# EasyEDA schematic pcb.json
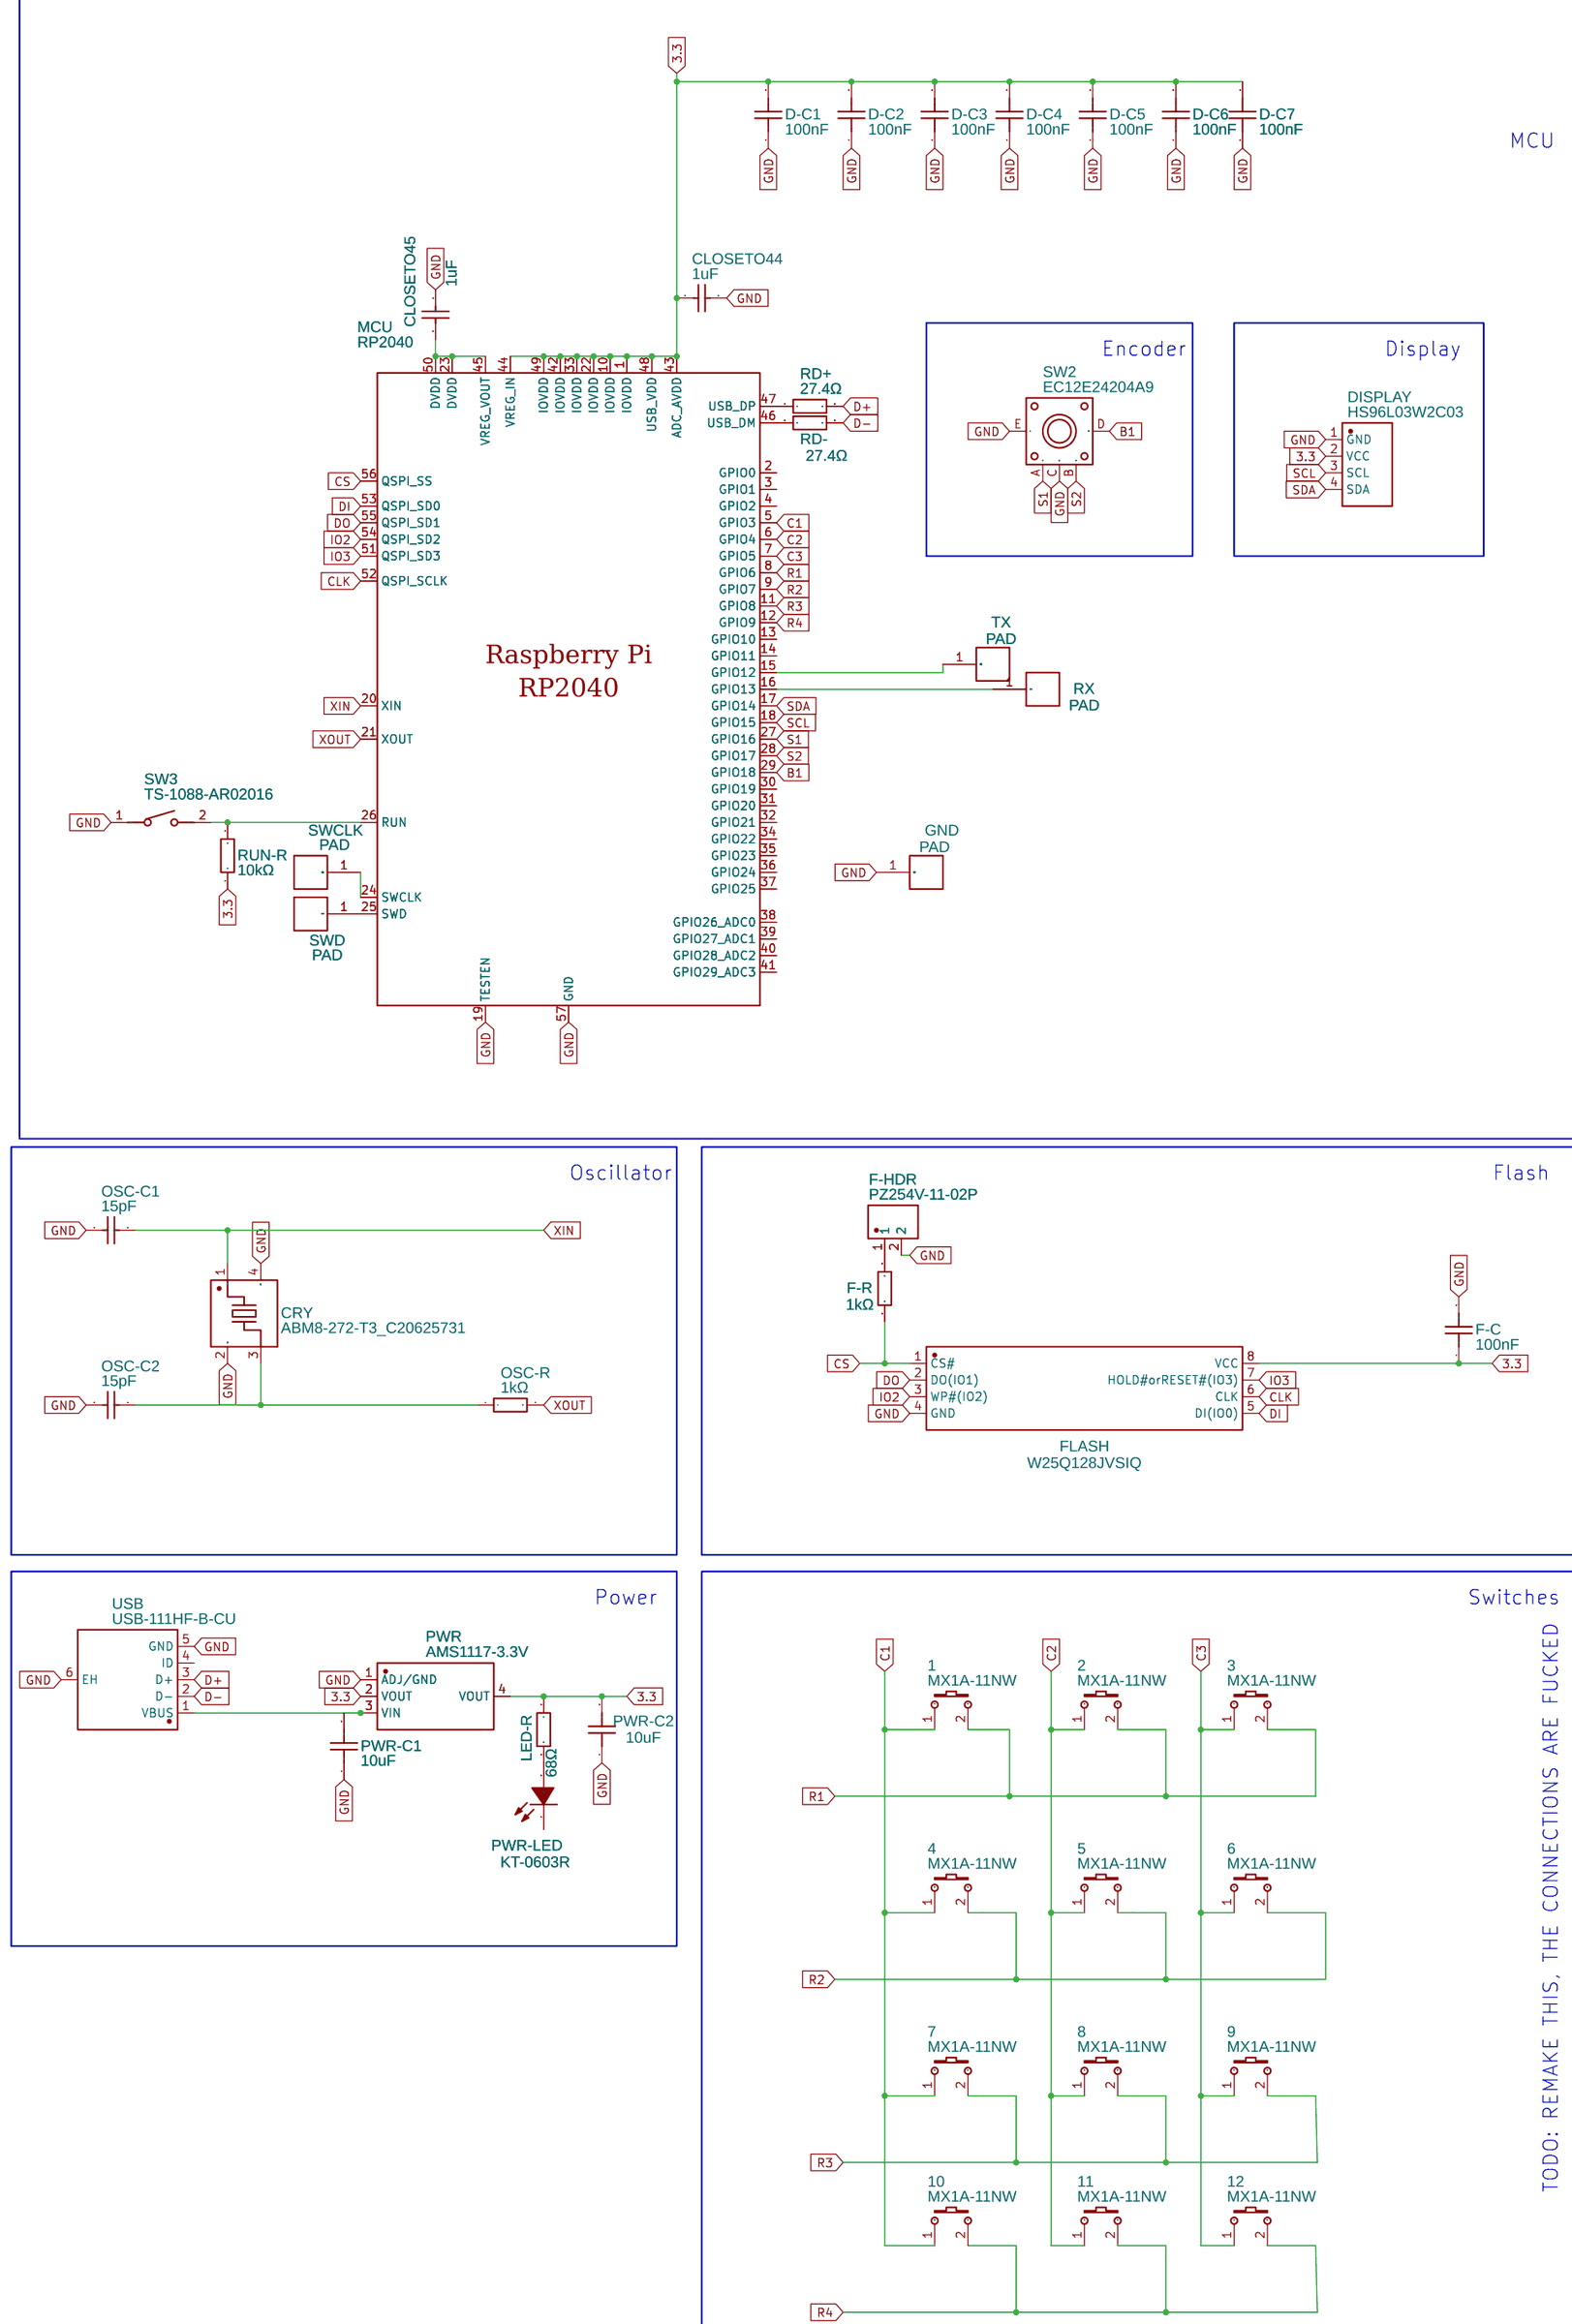
[diagram p0: schematic sheet]

## Parts
1  MX1A-11NW  [SW-TH_MX1A-11NW]
2  MX1A-11NW  [SW-TH_MX1A-11NW]
3  MX1A-11NW  [SW-TH_MX1A-11NW]
4  MX1A-11NW  [SW-TH_MX1A-11NW]
5  MX1A-11NW  [SW-TH_MX1A-11NW]
6  MX1A-11NW  [SW-TH_MX1A-11NW]
7  MX1A-11NW  [SW-TH_MX1A-11NW]
8  MX1A-11NW  [SW-TH_MX1A-11NW]
9  MX1A-11NW  [SW-TH_MX1A-11NW]
10  MX1A-11NW  [SW-TH_MX1A-11NW]
11  MX1A-11NW  [SW-TH_MX1A-11NW]
12  MX1A-11NW  [SW-TH_MX1A-11NW]
CLOSETO44  1uF  [C0402]
CLOSETO45  1uF  [C0402]
CRY  ABM8-272-T3_C20625731  [CRYSTAL-SMD_4P-L3.2-W2.5-BL]
D-C1  100nF  [C0603]
D-C2  100nF  [C0603]
D-C3  100nF  [C0603]
D-C4  100nF  [C0603]
D-C5  100nF  [C0603]
D-C6  100nF  [C0603]
D-C7  100nF  [C0603]
DISPLAY  HS96L03W2C03  [OLED-TH_L27.8-W27.2-P2.54_C9900033791]
F-C  100nF  [C0603]
F-HDR  PZ254V-11-02P  [HDR-TH_2P-P2.54-V-M]
F-R  1kΩ  [R0805]
FLASH  W25Q128JVSIQ  [SOIC-8_L5.3-W5.3-P1.27-LS8.0-BL]
GND  PAD  [PADPAD]
LED-R  68Ω  [R1206]
MCU  RP2040  [LQFN-56_L7.0-W7.0-P0.4-EP]
OSC-C1  15pF  [C0805]
OSC-C2  15pF  [C0805]
OSC-R  1kΩ  [R0805]
PWR  AMS1117-3.3V  [SOT-223-4_L6.5-W3.5-P2.30-LS7.0-BR]
PWR-C1  10uF  [C0805]
PWR-C2  10uF  [C0805]
PWR-LED  KT-0603R  [LED0603-RD]
RD+  27.4Ω  [R0603]
RD-  27.4Ω  [R0603]
RUN-R  10kΩ  [R0805]
RX  PAD  [PADPAD]
SW2  EC12E24204A9  [SW-TH_EC12EXXXX]
SW3  TS-1088-AR02016  [SW-SMD_L3.9-W3.0-P4.45]
SWCLK  PAD  [PADPAD]
SWD  PAD  [PADPAD]
TX  PAD  [PADPAD]
USB  USB-111HF-B-CU  [MICRO-USB-SMD_HOOYA_USB-111HF-B-CU]

## Library data of the parts
1-12 = MX1A-11NW: Supplier: LCSC; Supplier Part: C3316924; Manufacturer: CHERRY; Contributor: lcsc
CLOSETO44 CLOSETO45 = GRM155R61E105KA12D: Supplier: LCSC; Manufacturer: muRata(村田); Supplier Part: C77009; JLCPCB Part Class: Extended Part
CRY = ABM8-272-T3_C20625731: Supplier: LCSC; Supplier Part: C20625731; Manufacturer: ABRACON; Manufacturer Part: ABM8-272-T3; JLCPCB Part Class: Extended Part; Contributor: lcsc
D-C1-D-C7 F-C = CC0603KRX7R9BB104: Supplier: LCSC; Manufacturer: YAGEO(国巨); Supplier Part: C14663; JLCPCB Part Class: Basic Part
DISPLAY = HS96L03W2C03: Contributor: lcsc; Supplier: LCSC; Supplier Part: C5248080; Manufacturer: HS(汉昇); JLCPCB Part Class: Extended Part
F-HDR = PZ254V-11-02P: Contributor: LCSC; Supplier: LCSC; Supplier Part: C492401; Manufacturer: XFCN(兴飞); JLCPCB Part Class: Extended Part
F-R OSC-R = 0805W8F1001T5E: Supplier: LCSC; Manufacturer: UNI-ROYAL(厚声); Supplier Part: C17513; JLCPCB Part Class: Basic Part
FLASH = W25Q128JVSIQ: Contributor: LCSC; Supplier: LCSC; Supplier Part: C113767; Manufacturer: WINBOND(华邦); JLCPCB Part Class: Extended Part
GND RX SWCLK SWD TX = PAD: Contributor: GURBUZ
LED-R = 1206W4F680JT5E: Supplier: LCSC; Manufacturer: UNI-ROYAL(厚声); Supplier Part: C17976; JLCPCB Part Class: Extended Part
MCU = RP2040: Contributor: LCSC; Supplier: LCSC; Supplier Part: C2040; Manufacturer: Raspberry Pi(树莓派); JLCPCB Part Class: Extended Part
OSC-C1 OSC-C2 = 0805CG150J500NT: Supplier: LCSC; Manufacturer: FH(风华); Supplier Part: C63339; JLCPCB Part Class: Extended Part
PWR = AMS1117-3.3V: Contributor: LCSC; Supplier: LCSC; Supplier Part: C2688239; Manufacturer: WPMtek(维攀); JLCPCB Part Class: Extended Part
PWR-C1 PWR-C2 = CL21A106KAYNNNE: Supplier: LCSC; Manufacturer: SAMSUNG(三星); Supplier Part: C15850; JLCPCB Part Class: Basic Part
PWR-LED = KT-0603R: Supplier: LCSC; Manufacturer: KENTO; Supplier Part: C2286; JLCPCB Part Class: Basic Part
RD+ RD- = RS-03K27R4FT: Contributor: LCSC; Supplier: LCSC; Supplier Part: C321831; Manufacturer: FH(风华); JLCPCB Part Class: Extended Part
RUN-R = 0805W8F1002T5E: Supplier: LCSC; Manufacturer: UNI-ROYAL(厚声); Supplier Part: C17414; JLCPCB Part Class: Basic Part
SW2 = EC12E24204A9: Contributor: LCSC; Supplier: LCSC; Supplier Part: C470599; Manufacturer: ALPSALPINE(阿尔卑斯阿尔派); JLCPCB Part Class: Extended Part
SW3 = TS-1088-AR02016: Contributor: LCSC; Supplier: LCSC; Supplier Part: C720477; Manufacturer: XUNPU(讯普); JLCPCB Part Class: Extended Part
USB = USB-111HF-B-CU: Contributor: lcsc; Supplier: LCSC; Supplier Part: C2939561; Manufacturer: HOOYA(皓宇电子); JLCPCB Part Class: Extended Part

## Nets
GND: CLOSETO44.2 CLOSETO45.1 CRY.2(GND) CRY.4(GND) D-C1.1 D-C2.1 D-C3.1 D-C4.1 D-C5.1 D-C6.1 D-C7.1 DISPLAY.1(GND) F-C.2 F-HDR.2 FLASH.4(GND) GND.1(PADPAD123) MCU.19(TESTEN) MCU.57(GND) OSC-C1.2 OSC-C2.2 PWR.1(ADJ/GND) PWR-C1.1 PWR-C2.1 SW2.C SW2.E SW3.1 USB.5(GND) USB.6(EH)
3.3: CLOSETO44.1 D-C1.2 D-C2.2 D-C3.2 D-C4.2 D-C5.2 D-C6.2 D-C7.2 DISPLAY.2(VCC) F-C.1 FLASH.8(VCC) LED-R.1 MCU.1(IOVDD) MCU.10(IOVDD) MCU.22(IOVDD) MCU.33(IOVDD) MCU.42(IOVDD) MCU.43(ADC_AVDD) MCU.44(VREG_IN) MCU.48(USB_VDD) MCU.49(IOVDD) PWR.2(VOUT) PWR.4(VOUT) PWR-C2.2 RUN-R.2
B1: MCU.29(GPIO18) SW2.D
C1: 1.1 4.1 7.1 10.1 MCU.5(GPIO3)
C2: 2.1 5.1 8.1 11.1 MCU.6(GPIO4)
C3: 3.1 6.1 9.1 12.1 MCU.7(GPIO5)
CLK: FLASH.6(CLK) MCU.52(QSPI_SCLK)
CS: F-R.2 FLASH.1(CS#) MCU.56(QSPI_SS)
D+: RD+.2 USB.3(D+)
D-: RD-.2 USB.2(D-)
DI: FLASH.5(DI(IO0)) MCU.53(QSPI_SD0)
DO: FLASH.2(DO(IO1)) MCU.55(QSPI_SD1)
IO2: FLASH.3(WP#(IO2)) MCU.54(QSPI_SD2)
IO3: FLASH.7(HOLD#orRESET#(IO3)) MCU.51(QSPI_SD3)
R1: 1.2 2.2 3.2 MCU.8(GPIO6)
R2: 4.2 5.2 6.2 MCU.9(GPIO7)
R3: 7.2 8.2 9.2 MCU.11(GPIO8)
R4: 10.2 11.2 12.2 MCU.12(GPIO9)
S1: MCU.27(GPIO16) SW2.A
S2: MCU.28(GPIO17) SW2.B
SCL: DISPLAY.3(SCL) MCU.18(GPIO15)
SDA: DISPLAY.4(SDA) MCU.17(GPIO14)
XIN: CRY.1 MCU.20(XIN) OSC-C1.1
XOUT: MCU.21(XOUT) OSC-R.2
Net-(CLOSETO45-2): CLOSETO45.2 MCU.23(DVDD) MCU.45(VREG_VOUT) MCU.50(DVDD)
Net-(CRY-3): CRY.3 OSC-C2.1 OSC-R.1
Net-(F-HDR-1): F-HDR.1 F-R.1
Net-(LED-R-2): LED-R.2 PWR-LED.2(A)
Net-(MCU-15): MCU.15(GPIO12) TX.1(PADPAD123)
Net-(MCU-16): MCU.16(GPIO13) RX.1(PADPAD123)
Net-(MCU-24): MCU.24(SWCLK) SWCLK.1(PADPAD123)
Net-(MCU-25): MCU.25(SWD) SWD.1(PADPAD123)
Net-(MCU-26): MCU.26(RUN) RUN-R.1 SW3.2
Net-(MCU-46): MCU.46(USB_DM) RD-.1
Net-(MCU-47): MCU.47(USB_DP) RD+.1
Net-(PWR-3): PWR.3(VIN) PWR-C1.2 USB.1(VBUS)

Not connected (* = marked no-connect by the designer): MCU 2(GPIO0) 3(GPIO1) 4(GPIO2) 13(GPIO10) 14(GPIO11) 30(GPIO19) 31(GPIO20) 32(GPIO21) 34(GPIO22) 35(GPIO23) 36(GPIO24) 37(GPIO25) 38(GPIO26_ADC0) 39(GPIO27_ADC1) 40(GPIO28_ADC2) 41(GPIO29_ADC3); PWR-LED 1(K); USB 4(ID)

## Notes on the sheet
- MCU
- Encoder
- Display
- Oscillator
- Flash
- Power
- Switches
- TODO: REMAKE THIS, THE CONNECTIONS ARE FUCKED
